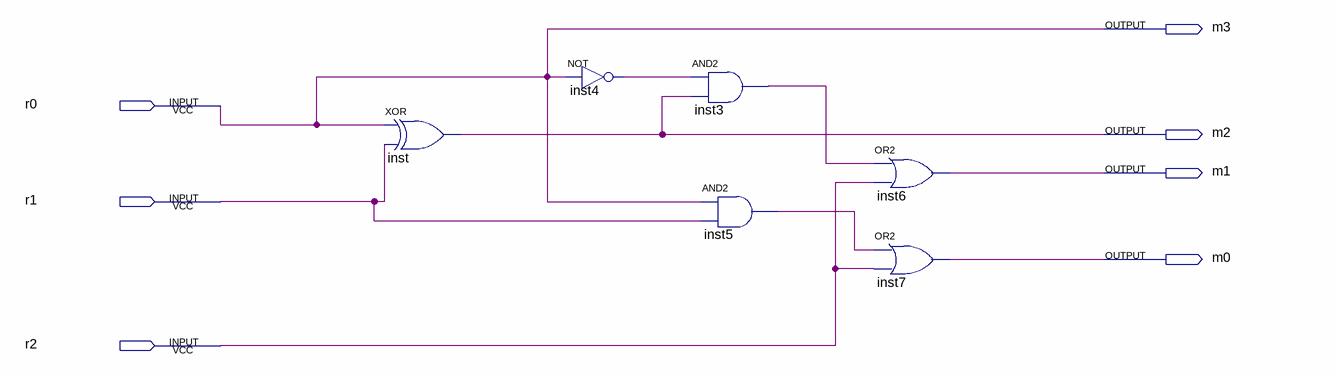
[diagram p0: schematic sheet]
// Quartus schematic REMA.bdf as structural Verilog: 6 symbols, 7 pins
module REMA (
  input  r0,
  input  r1,
  input  r2,
  output m3,
  output m2,
  output m1,
  output m0
);

  wire inst3_out, inst4_out, inst5_out;

  xor inst (m2, r0, r1);
  not inst4 (inst4_out, r0);
  and inst3 (inst3_out, inst4_out, m2);
  and inst5 (inst5_out, r0, r1);
  or inst6 (m1, inst3_out, r2);
  or inst7 (m0, inst5_out, r2);

  assign m3 = r0;
endmodule
